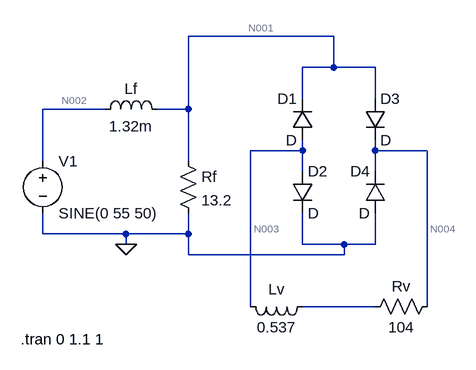
[diagram p0: schematic Draft1.asc]
Draft1.asc, the LTspice schematic file:
Version 4
SHEET 1 880 680
WIRE 496 -80 272 -80
WIRE 496 -32 496 -80
WIRE 496 -32 448 -32
WIRE 560 -32 496 -32
WIRE 448 16 448 -32
WIRE 560 16 560 -32
WIRE 144 32 48 32
WIRE 272 32 272 -80
WIRE 272 32 224 32
WIRE 448 96 448 80
WIRE 448 96 368 96
WIRE 560 96 560 80
WIRE 640 96 560 96
WIRE 48 112 48 32
WIRE 272 112 272 32
WIRE 448 128 448 96
WIRE 560 128 560 96
WIRE 48 224 48 192
WIRE 176 224 48 224
WIRE 272 224 272 192
WIRE 272 224 176 224
WIRE 176 240 176 224
WIRE 448 240 448 192
WIRE 512 240 448 240
WIRE 560 240 560 192
WIRE 560 240 512 240
WIRE 272 256 272 224
WIRE 512 256 512 240
WIRE 512 256 272 256
WIRE 368 336 368 96
WIRE 560 336 448 336
WIRE 640 336 640 96
FLAG 176 240 0
SYMBOL voltage 48 96 R0
WINDOW 123 0 0 Left 0
WINDOW 39 0 0 Left 0
SYMATTR InstName V1
SYMATTR Value SINE(0 55 50)
SYMBOL ind 128 48 R270
WINDOW 0 32 56 VTop 2
WINDOW 3 5 56 VBottom 2
SYMATTR InstName Lf
SYMATTR Value 1.32m
SYMBOL res 256 96 R0
SYMATTR InstName Rf
SYMATTR Value 13.2
SYMBOL diode 464 80 R180
WINDOW 0 24 64 Left 2
WINDOW 3 24 0 Left 2
SYMATTR InstName D1
SYMBOL diode 432 128 R0
SYMATTR InstName D2
SYMBOL diode 544 16 R0
SYMATTR InstName D3
SYMBOL diode 576 192 R180
WINDOW 0 24 64 Left 2
WINDOW 3 24 0 Left 2
SYMATTR InstName D4
SYMBOL ind 464 320 R90
WINDOW 0 5 56 VBottom 2
WINDOW 3 32 56 VTop 2
SYMATTR InstName Lv
SYMATTR Value 0.537
SYMBOL res 656 320 R90
WINDOW 0 0 56 VBottom 2
WINDOW 3 32 56 VTop 2
SYMATTR InstName Rv
SYMATTR Value 104
TEXT 14 386 Left 2 !.tran 0 1.1 1

The netlist it stands for:
* Draft1.asc
V1 N002 0 SINE(0 55 50)
Lf N002 N001 1.32m
Rf N001 0 13.2
D1 N003 N001 D
D2 N003 0 D
D3 N001 N004 D
D4 0 N004 D
Lv N005 N003 0.537
Rv N004 N005 104
.model D D
.lib standard.dio
.tran 0 1.1 1
.backanno
.end

* Results of the author's LTspice run, read from the files saved beside the schematic
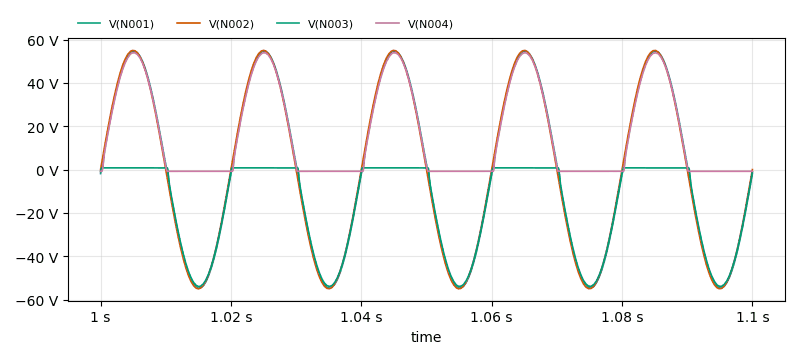
[diagram p1: Transient Analysis of Draft1.asc, plotted from the saved traces]
* Transient Analysis, 1 run:
*   V(N001): min -54.76 V, max 54.76 V, average 786 µV, rms 38.69 V, last -1.802 V
*   V(N002): min -54.99 V, max 55 V, average 28.87 µV, rms 38.88 V, last 0 V
*   V(N003): min -53.95 V, max 808.9 mV, average -16.57 V, rms 26.85 V, last -998.9 mV
*   V(N004): min -808.9 mV, max 53.95 V, average 16.57 V, rms 26.85 V, last -803.1 mV